# EAGLE design TouchGlove (EAGLE 9.1.2)
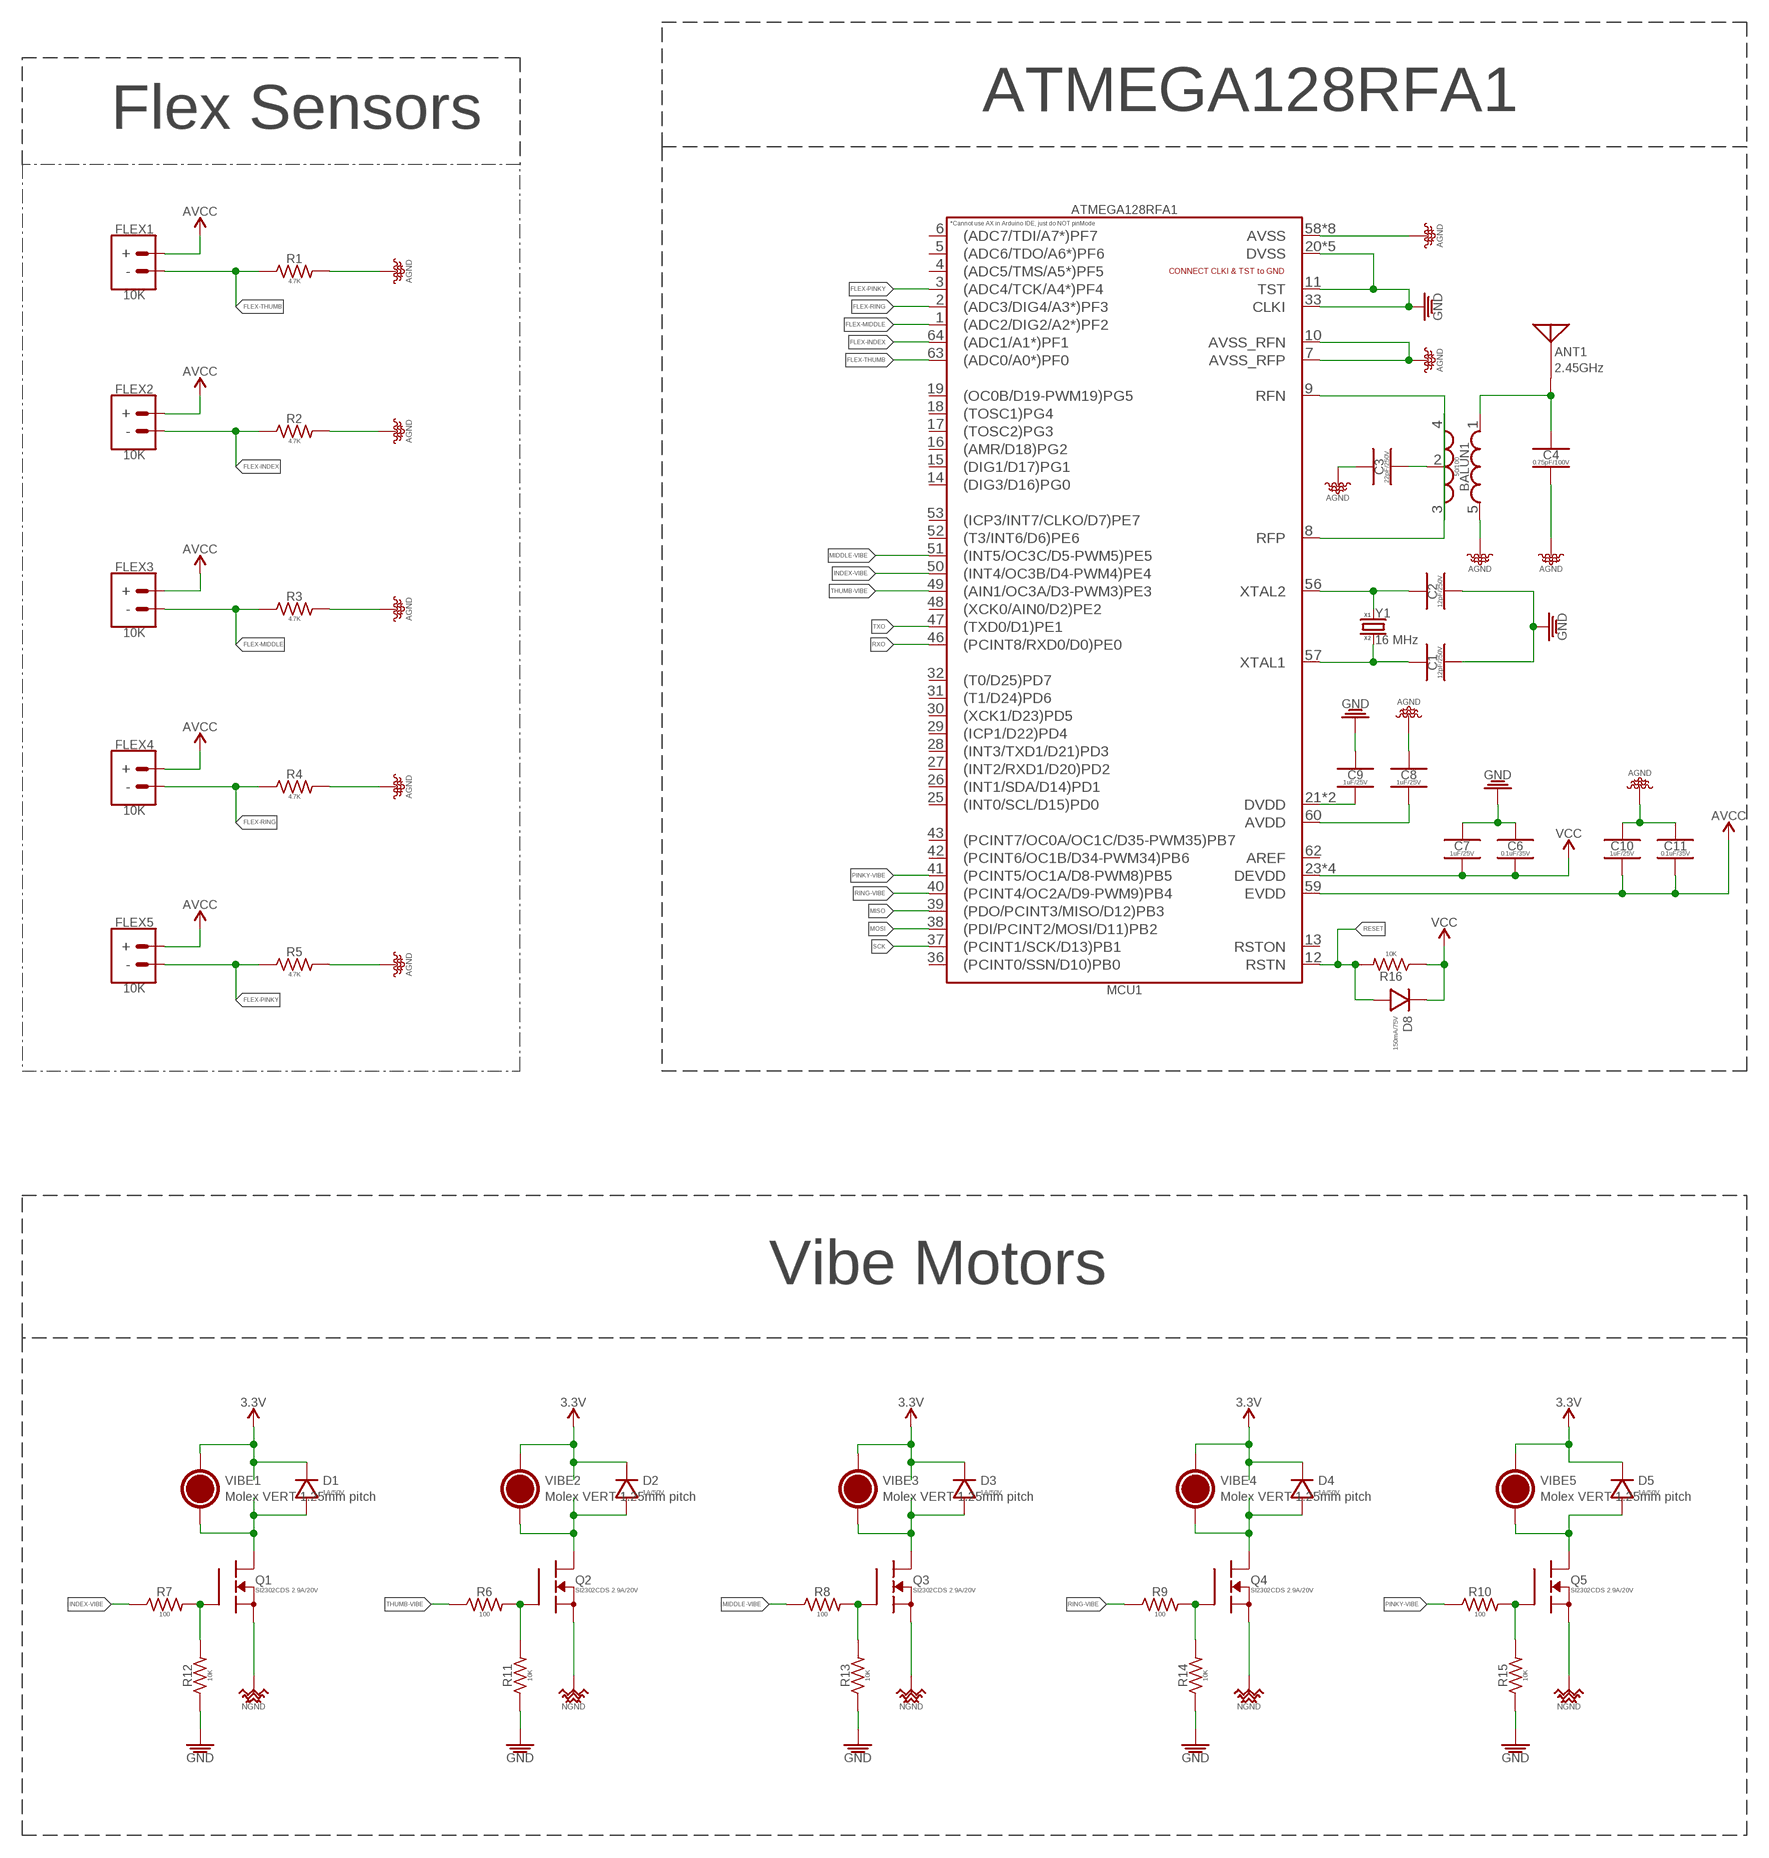
[diagram p0: schematic, sheet 1, part 1 of 2]
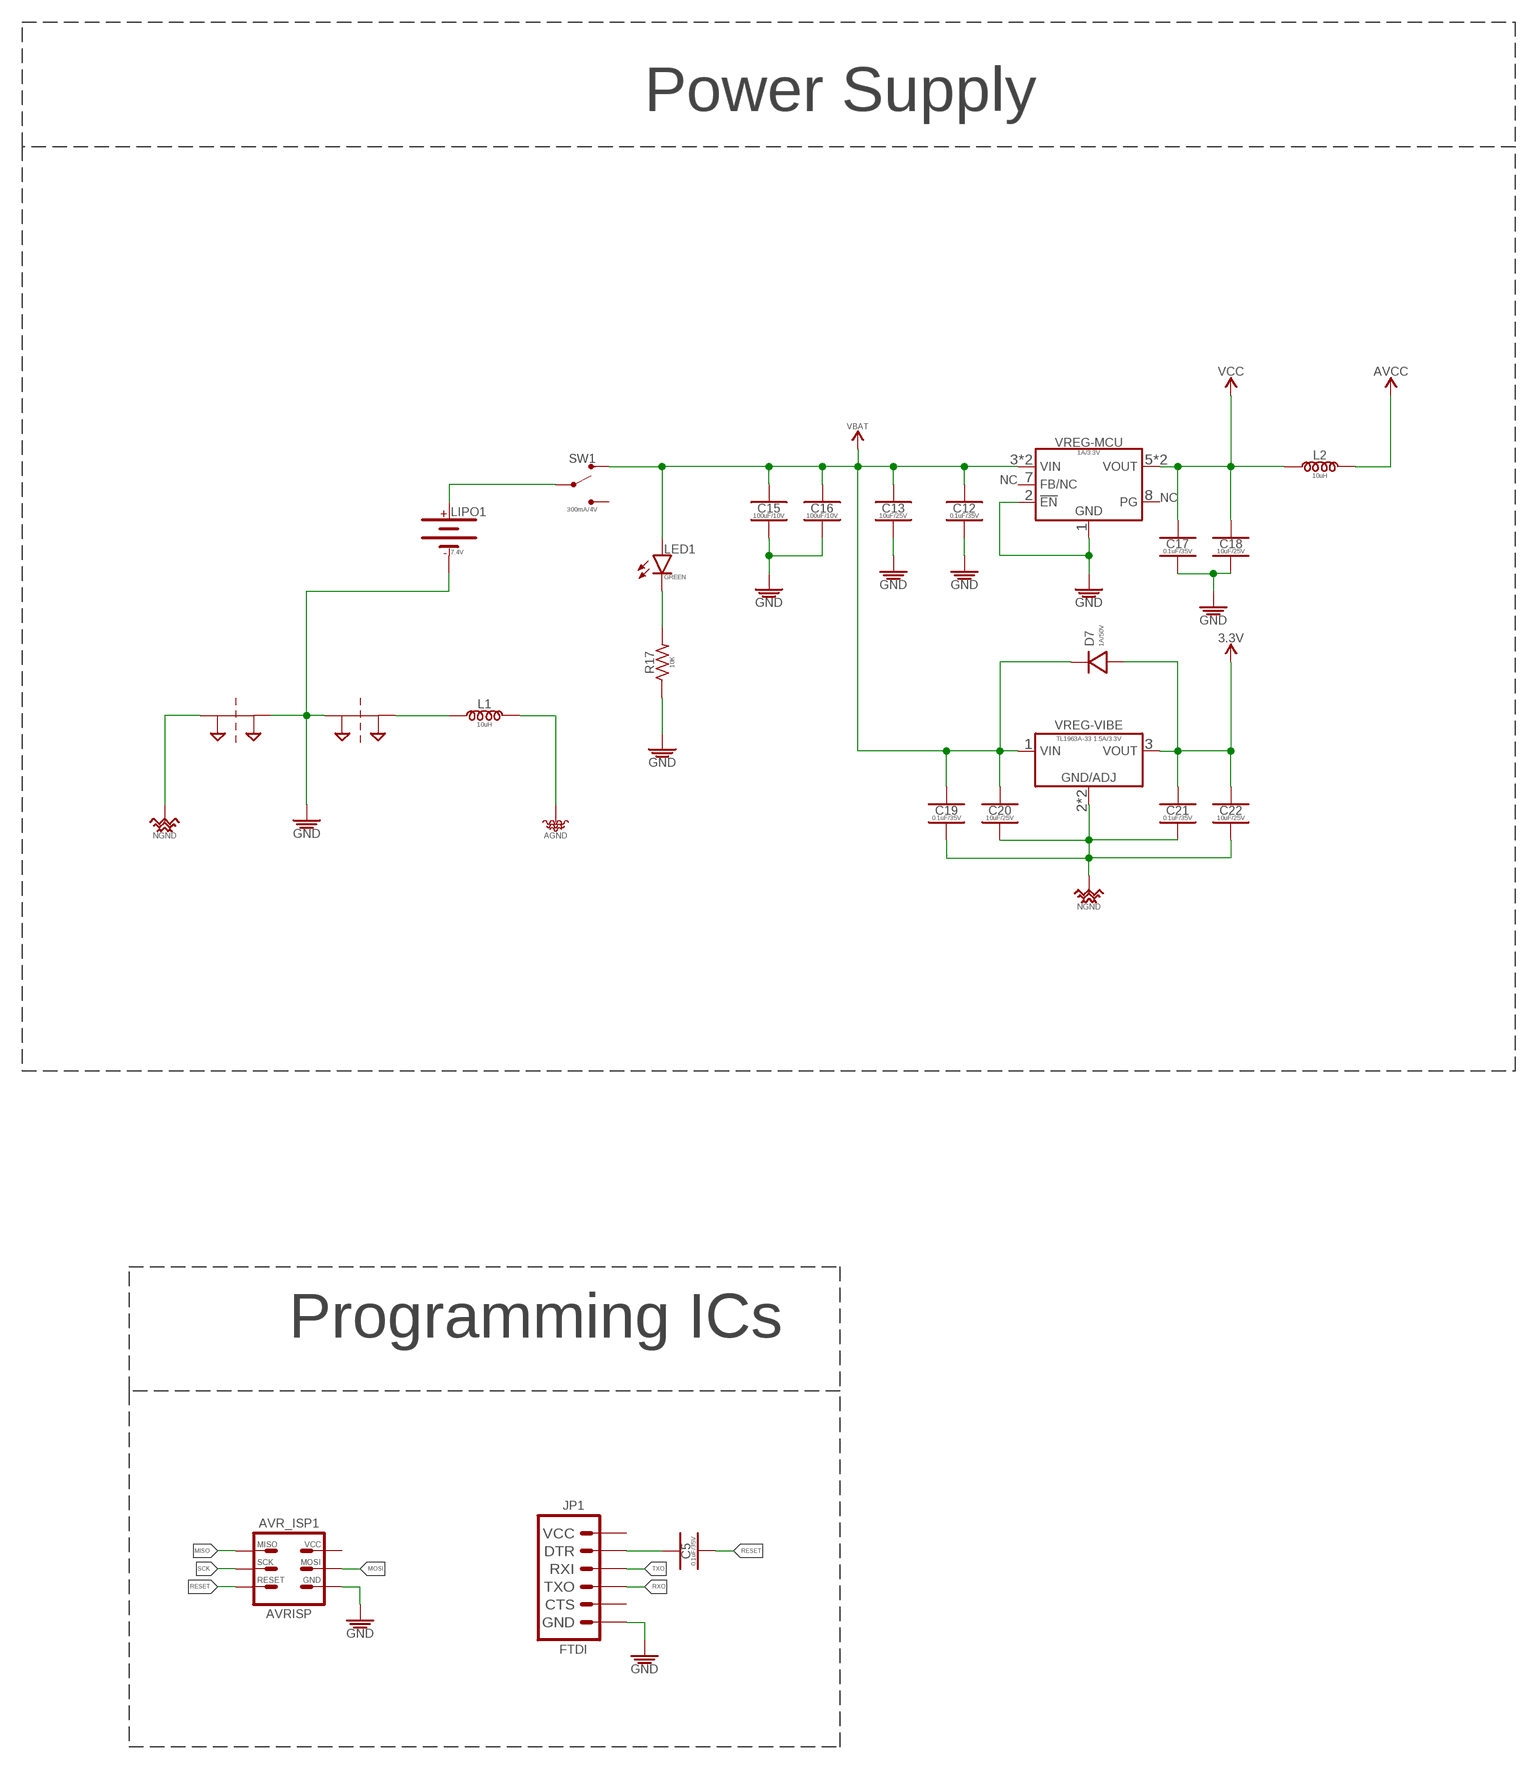
[diagram p1: schematic, sheet 1, part 2 of 2]

## Parts
ANT1  2.45GHz  ANTENNA_SMD_CHP-2.45GHZ-0.5DBI-3W  [ANTC6522X100]
AVR_ISP1  AVRISP  AVR_SPI_PRG_6_PTH_VERT-MALE  [2X3-NS]
BALUN1  50/100  BALUN_SMD-0805_UNBAL/BAL-50/100  [RESCAXE65P200X125X95-6]
C1  12pF/250V  12PF_SMD-0805_250V-5%  [CAPC2012X95_SMD-0805]
C2  12pF/250V  12PF_SMD-0805_250V-5%  [CAPC2012X95_SMD-0805]
C3  22pF/250V  22PF_CER_SMD-0805_250V-5%  [CAPC2012X95_SMD-0805]
C4  0.75pF/100V  0.75PF_CER_SMD-0805_100V-33%  [CAPC2012X95_SMD-0805]
C5  0.1uF/35V  0.1UF_SMD-0805_35V-10%  [CAPC2012X95_SMD-0805]
C6  0.1uF/35V  0.1UF_SMD-0805_35V-10%  [CAPC2012X95_SMD-0805]
C7  1uF/25V  1UF_CER_SMD-0805_25V-10%  [CAPC2012X95_SMD-0805]
C8  1uF/25V  1UF_CER_SMD-0805_25V-10%  [CAPC2012X95_SMD-0805]
C9  1uF/25V  1UF_CER_SMD-0805_25V-10%  [CAPC2012X95_SMD-0805]
C10  1uF/25V  1UF_CER_SMD-0805_25V-10%  [CAPC2012X95_SMD-0805]
C11  0.1uF/35V  0.1UF_SMD-0805_35V-10%  [CAPC2012X95_SMD-0805]
C12  0.1uF/35V  0.1UF_SMD-0805_35V-10%  [CAPC2012X95_SMD-0805]
C13  10uF/25V  10UF_CER_SMD-0805_25V-10%  [CAPC2012X95_SMD-0805]
C15  100uF/10V  100UF_CER_SMD-1210_16V-20%  [CAPC3225X270_SMD-1210]
C16  100uF/10V  100UF_CER_SMD-1210_16V-20%  [CAPC3225X270_SMD-1210]
C17  0.1uF/35V  0.1UF_SMD-0805_35V-10%  [CAPC2012X95_SMD-0805]
C18  10uF/25V  10UF_CER_SMD-0805_25V-10%  [CAPC2012X95_SMD-0805]
C19  0.1uF/35V  0.1UF_SMD-0805_35V-10%  [CAPC2012X95_SMD-0805]
C20  10uF/25V  10UF_CER_SMD-0805_25V-10%  [CAPC2012X95_SMD-0805]
C21  0.1uF/35V  0.1UF_SMD-0805_35V-10%  [CAPC2012X95_SMD-0805]
C22  10uF/25V  10UF_CER_SMD-0805_25V-10%  [CAPC2012X95_SMD-0805]
D1  1A/50V  DIODE_GENERAL-PURPOSE_SMD_GP_1A-50V  [SODFL3516X170]
D2  1A/50V  DIODE_GENERAL-PURPOSE_SMD_GP_1A-50V  [SODFL3516X170]
D3  1A/50V  DIODE_GENERAL-PURPOSE_SMD_GP_1A-50V  [SODFL3516X170]
D4  1A/50V  DIODE_GENERAL-PURPOSE_SMD_GP_1A-50V  [SODFL3516X170]
D5  1A/50V  DIODE_GENERAL-PURPOSE_SMD_GP_1A-50V  [SODFL3516X170]
D7  1A/50V  DIODE_GENERAL-PURPOSE_SMD_GP_1A-50V  [SODFL3516X170]
D8  150mA/75V  DIODE_GENERAL-PURPOSE_SMD-0402_GP_150MA-75V  [DFN100X60X55-2]
FLEX1  10K  FLEX_SENSOR_0530470210_VERT-MALE_PITCH-1.25MM  [_MOLEX-0530470210_VERT_PITCH-1.25MM]
FLEX2  10K  FLEX_SENSOR_0530470210_VERT-MALE_PITCH-1.25MM  [_MOLEX-0530470210_VERT_PITCH-1.25MM]
FLEX3  10K  FLEX_SENSOR_0530470210_VERT-MALE_PITCH-1.25MM  [_MOLEX-0530470210_VERT_PITCH-1.25MM]
FLEX4  10K  FLEX_SENSOR_0530470210_VERT-MALE_PITCH-1.25MM  [_MOLEX-0530470210_VERT_PITCH-1.25MM]
FLEX5  10K  FLEX_SENSOR_0530470210_VERT-MALE_PITCH-1.25MM  [_MOLEX-0530470210_VERT_PITCH-1.25MM]
JP1  FTDI  FTDI_PTH_RA-MALE  [FTDI_BASIC-6PIN-MALE-RA]
L1  10uH  10UH_SMD-0805_0.5A-0.65OHM-10%  [INDC2012X145]
L2  10uH  10UH_SMD-0805_0.5A-0.65OHM-10%  [INDC2012X145]
LED1  GREEN  LED_SMD-0805_DISCRETE_GREEN_  [LEDC2012X120_LED-0805]
LIPO1  7.4V  BATTERY-CONNECTOR_MOLEX_89401_RA-MALE_PITCH-2MM  [BATTERY_MOLEX-89401_RA_PITCH-2MM]
MCU1  ATMEGA128RFA1  ATMEGA128RFA1_VFQFN-64_EXPOSED-PAD  [QFN50P900X900X90-64]
Q1  SI2302CDS 2.9A/20V  MOSFET_N-CHANNEL_SI2302CDS_2.9A-20V-0.057OHM_  [SOT95P287X112-3]
Q2  SI2302CDS 2.9A/20V  MOSFET_N-CHANNEL_SI2302CDS_2.9A-20V-0.057OHM_  [SOT95P287X112-3]
Q3  SI2302CDS 2.9A/20V  MOSFET_N-CHANNEL_SI2302CDS_2.9A-20V-0.057OHM_  [SOT95P287X112-3]
Q4  SI2302CDS 2.9A/20V  MOSFET_N-CHANNEL_SI2302CDS_2.9A-20V-0.057OHM_  [SOT95P287X112-3]
Q5  SI2302CDS 2.9A/20V  MOSFET_N-CHANNEL_SI2302CDS_2.9A-20V-0.057OHM_  [SOT95P287X112-3]
R1  4.7K  4.7KΩ_SMD-0805_1/8W_5%  [RESC2012X60_SMD-0805]
R2  4.7K  4.7KΩ_SMD-0805_1/8W_5%  [RESC2012X60_SMD-0805]
R3  4.7K  4.7KΩ_SMD-0805_1/8W_5%  [RESC2012X60_SMD-0805]
R4  4.7K  4.7KΩ_SMD-0805_1/8W_5%  [RESC2012X60_SMD-0805]
R5  4.7K  4.7KΩ_SMD-0805_1/8W_5%  [RESC2012X60_SMD-0805]
R6  100  100Ω_SMD-0805_1/8W-5%  [RESC2012X60_SMD-0805]
R7  100  100Ω_SMD-0805_1/8W-5%  [RESC2012X60_SMD-0805]
R8  100  100Ω_SMD-0805_1/8W-5%  [RESC2012X60_SMD-0805]
R9  100  100Ω_SMD-0805_1/8W-5%  [RESC2012X60_SMD-0805]
R10  100  100Ω_SMD-0805_1/8W-5%  [RESC2012X60_SMD-0805]
R11  10K  10KΩ_SMD-0805_1/8W-5%  [RESC2012X60_SMD-0805]
R12  10K  10KΩ_SMD-0805_1/8W-5%  [RESC2012X60_SMD-0805]
R13  10K  10KΩ_SMD-0805_1/8W-5%  [RESC2012X60_SMD-0805]
R14  10K  10KΩ_SMD-0805_1/8W-5%  [RESC2012X60_SMD-0805]
R15  10K  10KΩ_SMD-0805_1/8W-5%  [RESC2012X60_SMD-0805]
R16  10K  10KΩ_SMD-0805_1/8W-5%  [RESC2012X60_SMD-0805]
R17  10K  10KΩ_SMD-0805_1/8W-5%  [RESC2012X60_SMD-0805]
SUPPLY38  2PT_GND_TIE  [2PT_GND_TIE]
SUPPLY39  2PT_GND_TIE  [2PT_GND_TIE]
SW1  300mA/4V  SWITCH_SPDT_RA_SMD_300MA-4V_6.7L-2.6W  [SW_SLIDE_SPDT_RA_SMD_4V_300MA_6.7L-2.6W]
VIBE1  Molex VERT 1.25mm pitch  VIBE-MOTOR_CONNECTOR_0530470210_VERT-MALE_PITCH-1.25MM  [_MOLEX-0530470210_VERT_PITCH-1.25MM]
VIBE2  Molex VERT 1.25mm pitch  VIBE-MOTOR_CONNECTOR_0530470210_VERT-MALE_PITCH-1.25MM  [_MOLEX-0530470210_VERT_PITCH-1.25MM]
VIBE3  Molex VERT 1.25mm pitch  VIBE-MOTOR_CONNECTOR_0530470210_VERT-MALE_PITCH-1.25MM  [_MOLEX-0530470210_VERT_PITCH-1.25MM]
VIBE4  Molex VERT 1.25mm pitch  VIBE-MOTOR_CONNECTOR_0530470210_VERT-MALE_PITCH-1.25MM  [_MOLEX-0530470210_VERT_PITCH-1.25MM]
VIBE5  Molex VERT 1.25mm pitch  VIBE-MOTOR_CONNECTOR_0530470210_VERT-MALE_PITCH-1.25MM  [_MOLEX-0530470210_VERT_PITCH-1.25MM]
VREG-MCU  1A/3.3V  VREG_TPS768XX_ULDO_FAST-TRANSIENT_TPS76833QDR_1A-3.3V  [SOIC127P600X265-8]
VREG-VIBE  TL1963A-33 1.5A/3.3V  VREG_TL1963A-XX_1.5A_LN_LDO_FAST-TRANSIENT_SOT-223-4_TL1963A-33_1.5A-3.3V  [SOT229P700X180-4]
Y1  16 MHz  CRYSTAL_ABM3B_16MHZ_18PF  [OSCCC500X320X110]

## Nets
3.3V: C21.1 C22.1 D1.K D2.K D3.K D4.K D5.K D7.A VIBE1.1(+) VIBE2.1(+) VIBE3.1(+) VIBE4.1(+) VIBE5.1(+) VREG-VIBE.3(VO)
AGND: BALUN1.5(GND) C3.1 C4.2 C8.1 C10.1 C11.1 L1.2 MCU1.7(AVSS_RFP) MCU1.10(AVSS_RFN) MCU1.58(AVSS) MCU1.61(AVSS) MCU1.EP(AVSS) MCU1.P$1(AVSS) MCU1.P$2(AVSS) MCU1.P$3(AVSS) MCU1.P$4(AVSS) MCU1.P$5(AVSS) R1.2 R2.2 R3.2 R4.2 R5.2
AVCC: C10.2 C11.2 FLEX1.1(+) FLEX2.1(+) FLEX3.1(+) FLEX4.1(+) FLEX5.1(+) L2.2 MCU1.59(EVDD)
FLEX-INDEX: FLEX2.2(-) MCU1.64((ADC1/A1*)PF1) R2.1
FLEX-MIDDLE: FLEX3.2(-) MCU1.1((ADC2/DIG2/A2*)PF2) R3.1
FLEX-PINKY: FLEX5.2(-) MCU1.3((ADC4/TCK/A4*)PF4) R5.1
FLEX-RING: FLEX4.2(-) MCU1.2((ADC3/DIG4/A3*)PF3) R4.1
FLEX-THUMB: FLEX1.2(-) MCU1.63((ADC0/A0*)PF0) R1.1
GND: AVR_ISP1.GND C1.2 C2.2 C6.1 C7.1 C9.1 C12.2 C13.2 C15.2 C16.2 C17.2 C18.2 JP1.GND LIPO1.- MCU1.11(TST) MCU1.20(DVSS) MCU1.24(DVSS) MCU1.33(CLKI) MCU1.35(DVSS) MCU1.45(DVSS) MCU1.55(DVSS) R11.1 R12.1 R13.1 R14.1 R15.1 R17.1 SUPPLY38.P$2 SUPPLY39.P$1 VREG-MCU.1(GND) VREG-MCU.2(!EN)
INDEX-VIBE: MCU1.50((INT4/OC3B/D4-PWM4)PE4) R7.1
MIDDLE-VIBE: MCU1.51((INT5/OC3C/D5-PWM5)PE5) R8.1
MISO: AVR_ISP1.MISO MCU1.39((PDO/PCINT3/MISO/D12)PB3)
MOSI: AVR_ISP1.MOSI MCU1.38((PDI/PCINT2/MOSI/D11)PB2)
N$1: D1.A Q1.3(D) VIBE1.2(-)
N$2: D2.A Q2.3(D) VIBE2.2(-)
N$3: D3.A Q3.3(D) VIBE3.2(-)
N$4: D4.A Q4.3(D) VIBE4.2(-)
N$5: D5.A Q5.3(D) VIBE5.2(-)
N$6: C2.1 MCU1.56(XTAL2) Y1.1(XTAL1)
N$7: C1.1 MCU1.57(XTAL1) Y1.3(XTAL2)
N$8: BALUN1.2(GND) C3.2
N$9: ANT1.1(SIGNAL) BALUN1.1(IN) C4.1
N$10: BALUN1.3(OUT1) MCU1.9(RFN)
N$11: BALUN1.4(OUT2) MCU1.8(RFP)
N$12: C5.1 JP1.DTR
N$14: Q2.1(G) R6.2 R11.2
N$15: LIPO1.+ SW1.2(P)
N$16: Q1.1(G) R7.2 R12.2
N$18: Q3.1(G) R8.2 R13.2
N$19: L1.1 SUPPLY39.P$2
N$20: Q4.1(G) R9.2 R14.2
N$21: C8.2 MCU1.60(AVDD)
N$22: Q5.1(G) R10.2 R15.2
N$23: C9.2 MCU1.21(DVDD) MCU1.22(DVDD)
N$25: LED1.K R17.2
NGND: C19.2 C20.2 C21.2 C22.2 Q1.2(S) Q2.2(S) Q3.2(S) Q4.2(S) Q5.2(S) SUPPLY38.P$1 VREG-VIBE.2(GND) VREG-VIBE.4(GND)
PINKY-VIBE: MCU1.41((PCINT5/OC1A/D8-PWM8)PB5) R10.1
RESET: AVR_ISP1.RESET C5.2 D8.A MCU1.12(RSTN) R16.2
RING-VIBE: MCU1.40((PCINT4/OC2A/D9-PWM9)PB4) R9.1
RXO: JP1.TXO MCU1.46((PCINT8/RXD0/D0)PE0)
SCK: AVR_ISP1.SCK MCU1.37((PCINT1/SCK/D13)PB1)
THUMB-VIBE: MCU1.49((AIN1/OC3A/D3-PWM3)PE3) R6.1
TXO: JP1.RXI MCU1.47((TXD0/D1)PE1)
VBAT: C12.1 C13.1 C15.1 C16.1 C19.1 C20.1 D7.K LED1.A SW1.1(S1) VREG-MCU.3(VIN) VREG-MCU.4(VIN) VREG-VIBE.1(VI)
VCC: C6.2 C7.2 C17.1 C18.1 D8.K L2.1 MCU1.23(DEVDD) MCU1.34(DEVDD) MCU1.44(DEVDD) MCU1.54(DEVDD) R16.1 VREG-MCU.5(VOUT) VREG-MCU.6(VOUT)
Unconnected: AVR_ISP1.VCC JP1.CTS JP1.VCC MCU1.4((ADC5/TMS/A5*)PF5) MCU1.5((ADC6/TDO/A6*)PF6) MCU1.6((ADC7/TDI/A7*)PF7) MCU1.13(RSTON) MCU1.14((DIG3/D16)PG0) MCU1.15((DIG1/D17)PG1) MCU1.16((AMR/D18)PG2) MCU1.17((TOSC2)PG3) MCU1.18((TOSC1)PG4) MCU1.19((OC0B/D19-PWM19)PG5) MCU1.25((INT0/SCL/D15)PD0) MCU1.26((INT1/SDA/D14)PD1) MCU1.27((INT2/RXD1/D20)PD2) MCU1.28((INT3/TXD1/D21)PD3) MCU1.29((ICP1/D22)PD4) MCU1.30((XCK1/D23)PD5) MCU1.31((T1/D24)PD6) MCU1.32((T0/D25)PD7) MCU1.36((PCINT0/SSN/D10)PB0) MCU1.42((PCINT6/OC1B/D34-PWM34)PB6) MCU1.43((PCINT7/OC0A/OC1C/D35-PWM35)PB7) MCU1.48((XCK0/AIN0/D2)PE2) MCU1.52((T3/INT6/D6)PE6) MCU1.53((ICP3/INT7/CLKO/D7)PE7) MCU1.62(AREF) SW1.3(S2) VREG-MCU.7(FB/NC) VREG-MCU.8(PG)

## Notes on the sheet
- Flex Sensors | ATMEGA128RFA1 | Power Supply
- Vibe Motors
- Programming ICs

## Library data of the parts
ANT1 = PiB_radio_frequency:ANTENNA: Chip antenna Single endded antenna. Common with smaller chip antennas. CHIP4 package is the GPS Chip Antenna SKU: GPS-08418. CHIP5 package is 2.4GHz chip antenna SKU: WRL-00144.; DATASHEET: https://linxtechnologies.com/wp/wp-content/uploads/ant-fff-chp-x.pdf; DIST: Digikey; DISTLINK: https://www.digikey.com/products/en?keywords=ANT-2.45-CHPCT-ND; DISTPN: ANT-2.45-CHPCT-ND; MFR: Linx Technologies Inc.; MPN: ANT-2.45-CHP-T
AVR_ISP1 = PiB_connectors:AVR_SPI_PRG_6: AVR ISP 6 Pin This is the reduced ISP connector for AVR programming. Common on Arduino. This footprint will take up less PCB space and can be used with a 10-pin to 6-pin adapter such as SKU: BOB-08508; DATASHEET: https://cdn.amphenol-icc.com/media/wysiwyg/files/drawing/67996.pdf; DIST: Digikey; DISTLINK: https://www.digikey.com/products/en?keywords=609-3234-ND; DISTPN: 609-3234-ND; MFR: Amphenol FCI; MPN: 67997-206HLF
BALUN1 = PiB_radio_frequency:BALUN: 0805 footprint balun- Ember 351/357; DATASHEET: http://katalog.we-online.de/pbs/datasheet/748421245.pdf; DIST: Digikey; DISTLINK: https://www.digikey.com/products/en?keywords=732-2230-6-ND; DISTPN: 732-2230-6-ND; MFR: Wurth Electronics Inc.; MPN: 748421245
C1 C2 = PiB_capacitors:12PF; DATASHEET: http://search.murata.co.jp/Ceramy/image/img/A01X/G101/ENG/GRM21A5C2E120JW01-01.pdf; DIST: Digikey; DISTLINK: https://www.digikey.com/products/en?keywords=490-5531-1-ND; DISTPN: 490-5531-1-ND; MFR: Murata Electronics North America; MPN: GRM21A5C2E120JW01D
C3 = PiB_capacitors:22PF; DATASHEET: http://search.murata.co.jp/Ceramy/image/img/A01X/G101/ENG/GRM21A5C2E220JW01-01.pdf; DIST: Digikey; DISTPN: 490-5534-1-ND; MFR: Murata Electronics North America; MPN: GRM21A5C2E220JW01D
C4 = PiB_capacitors:0.75PF; DATASHEET: http://search.murata.co.jp/Ceramy/image/img/A01X/G101/ENG/GQM2195C2AR75CB01-01.pdf; DIST: Digikey; DISTLINK: https://www.digikey.com/products/en?keywords=490-3585-1-ND; DISTPN: 490-3585-1-ND; MFR: Murata Electronics North America; MPN: GQM2195C2AR75CB01D
C5 C6 C11 C12 C17 C19 C21 = PiB_capacitors:0.1UF; DATASHEET: http://ds.yuden.co.jp/TYCOMPAS/ut/detail.do?productNo=GMK212BJ104KGHT&fileName=GMK212BJ104KGHT_SS&mode=specSheetDownload; DIST: Digikey; DISTLINK: https://www.digikey.com/products/en?keywords=587-3364-1-ND; DISTPN: 587-3364-1-ND; MFR: Taiyo Yuden; MPN: GMK212BJ104KGHT
C7-C10 = PiB_capacitors:1UF; DATASHEET: https://search.murata.co.jp/Ceramy/image/img/A01X/G101/ENG/GRM216R61E105KA12-01.pdf; DIST: Digikey; DISTLINK: https://www.digikey.com/products/en?keywords=490-1700-1-ND; DISTPN: 490-1700-1-ND; MFR: Murata Electronics North America; MPN: GRM216R61E105KA12D
C13 C18 C20 C22 = PiB_capacitors:10UF; DATASHEET: https://www.yuden.co.jp/productdata/catalog/mlcc_all_e.pdf; DIST: Digikey; DISTLINK: https://www.digikey.com/products/en?keywords=587-2985-1-ND; DISTPN: 587-2985-1-ND; MFR: Taiyo Yuden; MPN: TMK212BBJ106KG-T
C15 C16 = PiB_capacitors:100UF; DATASHEET: https://www.yuden.co.jp/productdata/catalog/mlcc01_hq_e.pdf; DIST: Digikey; DISTLINK: https://www.digikey.com/products/en?keywords=587-3432-1-ND; DISTPN: 587-3432-1-ND; MFR: Taiyo Yuden; MPN: LMK325ABJ107MMHT
D1-D5 D7 = PiB_discrete_semiconductors:DIODE_GENERAL-PURPOSE; DATASHEET: http://www.comchiptech.com/cms/UserFiles/CGRKM4001-HF%20Thru.%20CGRKM4007-HF%20RevG.pdf; DIST: Digikey; DISTLINK: https://www.digikey.com/products/en?keywords=641-1511-1-ND; DISTPN: 641-1511-1-ND; MFR: Comchip Technology; MPN: CGRKM4001-HF
D8 = PiB_discrete_semiconductors:DIODE_GENERAL-PURPOSE; DATASHEET: http://www.comchiptech.com/cms/UserFiles/CDSQR4148-HF-RevC213424.pdf; DIST: Digikey; DISTLINK: https://www.digikey.com/products/en?keywords=641-1677-1-ND; DISTPN: 641-1677-1-ND; MFR: Comchip Technology; MPN: CDSQR4148-HF
FLEX1-FLEX5 = PiB_sensors:FLEX_SENSOR; DATASHEET: http://www.spectrasymbol.com/wp-content/uploads/2016/12/FLEX-SENSOR-DATA-SHEET-v2014-Rev-A.pdf; DATASHEET_CONNECTOR1: https://www.molex.com/pdm_docs/sd/530470210_sd.pdf; DATASHEET_CONNECTOR2: https://www.molex.com/pdm_docs/sd/510210700_sd.pdf; DATASHEET_CRIMP: https://www.molex.com/pdm_docs/sd/500798000_sd.pdf; DIST: Sparkfun; DISTLINK: https://www.sparkfun.com/products/8606; DISTLINK_CONNECTOR1: https://www.digikey.com/products/en?keywords=WM1731-ND; DISTLINK_CONNECTOR2: https://www.digikey.com/products/en?keywords=WM1720-ND; DISTLINK_CRIMP: https://www.digikey.com/products/en?keywords=WM1142CT-ND; DISTPN: SEN-08606; DISTPN_CONNECTOR1: WM1731-ND; DISTPN_CONNECTOR2: WM1720-ND; DISTPN_CRIMP: WM1142CT-ND; DIST_CONNECTOR1: Digikey; DIST_CONNECTOR2: Digikey; DIST_CRIMP: Digikey; MFR: Spectra Symbol; MFR_CONNECTOR1: Molex, LLC; MFR_CONNECTOR2: Molex, LLC; MFR_CRIMP: Molex, LLC; MPN: FS-L-0095-103-ST; MPN_CONNECTOR1: 0530470210; MPN_CONNECTOR2: 51021-0200; MPN_CRIMP: 0500798000
JP1 = PiB_connectors:FTDI: FTDI Basic header with labels; DATASHEET: https://media.digikey.com/pdf/Data%20Sheets/Sparkfun%20PDFs/DEV-09873_Web.pdf; DATASHEET_CONNECTOR: https://cdn.amphenol-icc.com/media/wysiwyg/files/drawing/68015.pdf; DIST: Digikey; DISTLINK: https://www.digikey.com/products/en?keywords=1568-1104-ND; DISTLINK_CONNECTOR: https://www.digikey.com/products/en?keywords=609-3327-ND; DISTPN: 1568-1104-ND; DISTPN_CONNECTOR: 609-3327-ND; DIST_CONNECTOR: Digikey; MFR: SparkFun Electronics; MFR_CONNECTOR: Amphenol FCI; MPN: DEV-09873; MPN_CONNECTOR: 68016-406HLF
L1 L2 = PiB_inductors:10UH; DATASHEET: https://www.yuden.co.jp/productdata/catalog/wound02_e.pdf; DIST: Digikey; DISTLINK: https://www.digikey.com/products/en?keywords=587-2452-1-ND; DISTPN: 587-2452-1-ND; MFR: Taiyo Yuden; MPN: CB2012T100KR
LED1 = PiB_leds:LED; DATASHEET: http://optoelectronics.liteon.com/upload/download/DS22-2000-073/LTST-C170KGKT.pdf; DIST: Digikey; DISTLINK: https://www.digikey.com/products/en?keywords=160-1414-1-ND; DISTPN: 160-1414-1-ND; MFR: Lite-On Inc.; MPN: LTST-C170KGKT
LIPO1 = PiB_batteries:BATTERY-CONNECTOR_MOLEX; DATASHEET: https://www.molex.com/pdm_docs/sd/894010210_sd.pdf; DATASHEET_CONNECTOR: https://www.molex.com/pdm_docs/sd/873690200_sd.pdf; DATASHEET_CRIMP: https://www.molex.com/pdm_docs/sd/502128000_sd.pdf; DIST: Digikey; DISTLINK: https://www.digikey.com/products/en?keywords=WM14854-ND; DISTLINK_CONNECTOR: https://www.digikey.com/products/en?keywords=WM10118-ND; DISTLINK_CRIMP: https://www.digikey.com/products/en?keywords=WM4561CT-ND; DISTPN: WM14854-ND; DISTPN_CONNECTOR: WM10118-ND; DISTPN_CRIMP: WM4561CT-ND; DIST_CONNECTOR: Digikey; DIST_CRIMP: Digikey; MFR: Molex, LLC; MFR_CONNECTOR: Molex, LLC; MFR_CRIMP: Molex, LLC; MPN: 0894010210; MPN_CONNECTOR: 0873690200; MPN_CRIMP: 50212-8000
MCU1 = PiB_ic_microcontrollers:ATMEGA128RFA1: ATmega128RFA1 8-bit AVR Microcontroller with Low Power 2.4GHz Transceiver for ZigBee and IEEE 802.15.4; DATASHEET: http://www.microchip.com/mymicrochip/filehandler.aspx?ddocname=en590262; DIST: Digikey; DISTLINK: https://www.digikey.com/products/en?keywords=ATMEGA128RFA1-ZU-ND; DISTPN: ATMEGA128RFA1-ZU-ND; MFR: Microchip Technology; MPN: ATMEGA128RFA1-ZU
Q1-Q5 = PiB_discrete_semiconductors:MOSFET_N-CHANNEL; DATASHEET: http://www.vishay.com/docs/63653/si2302dds.pdf; DIST: Digikey; DISTLINK: https://www.digikey.com/products/en?keywords=SI2302DDS-T1-GE3CT-ND; DISTPN: SI2302DDS-T1-GE3CT-ND; MFR: Vishay Siliconix; MPN: SI2302DDS-T1-GE3
R1-R5 = PiB_resistors:4.7KΩ; DATASHEET: http://www.yageo.com/NewPortal/yageodocoutput?fileName=/pdf/R-Chip/PYu-RC_51_RoHS_P_0.pdf; DIST: Digikey; DISTLINK: https://www.digikey.com/products/en?keywords=YAG1334CT-ND; DISTPN: YAG1334CT-ND; MFR: Yageo; MPN: RC0805JR-074K7P
R6-R10 = PiB_resistors:100Ω; DATASHEET: http://www.yageo.com/NewPortal/yageodocoutput?fileName=/pdf/R-Chip/PYu-AC_51_RoHS_L_6.pdf; DIST: Digikey; DISTLINK: https://www.digikey.com/products/en?keywords=YAG3757CT-ND; DISTPN: YAG3757CT-ND; MFR: Yageo; MPN: AC0805JR-07100RL
R11-R17 = PiB_resistors:10KΩ; DATASHEET: http://www.yageo.com/documents/recent/PYu-RC_Group_51_RoHS_L_9.pdf; DIST: Digikey; DISTLINK: https://www.digikey.com/products/en?keywords=311-10KARCT-ND; DISTPN: 311-10KARCT-ND; MFR: Yageo; MPN: RC0805JR-0710KL
SUPPLY38 SUPPLY39 = PiB_power_symbols:2PT_GND_TIE
SW1 = PiB_switches:SWITCH_SPDT; CREATOR: MrSwirlyEyes; DATASHEET: https://media.digikey.com/pdf/Data%20Sheets/APEM%20Components%20PDFs/MA_Series_.pdf; DIST: Digikey; DISTLINK: https://www.digikey.com/products/en?keywords=679-1847-1-ND; DISTPN: 679-1847-1-ND; MFR: APEM Inc.; MPN: MA12RTR; TESTED: YES
VIBE1-VIBE5 = PiB_actuators:VIBE-MOTOR_CONNECTOR; DATASHEET: http://www.vibration-motor.com/products/download/C0825B002F.pdf; DATASHEET_CONNECTOR1: https://www.molex.com/pdm_docs/sd/530470210_sd.pdf; DATASHEET_CONNECTOR2: https://www.molex.com/pdm_docs/sd/510210700_sd.pdf; DATASHEET_CRIMP: https://www.molex.com/pdm_docs/sd/500798000_sd.pdf; DIST: Digikey; DISTLINK: https://www.digikey.com/products/en?keywords=1670-1002-ND; DISTLINK_CONNECTOR1: https://www.digikey.com/products/en?keywords=WM1731-ND; DISTLINK_CONNECTOR2: https://www.digikey.com/products/en?keywords=WM1720-ND; DISTLINK_CRIMP: https://www.digikey.com/products/en?keywords=WM1142CT-ND; DISTPN: 1670-1002-ND; DISTPN_CONNECTOR1: WM1731-ND; DISTPN_CONNECTOR2: WM1720-ND; DISTPN_CRIMP: WM1142CT-ND; DIST_CONNECTOR1: Digikey; DIST_CONNECTOR2: Digikey; DIST_CRIMP: Digikey; MFR: Jinlong Machinery & Electronics, Inc.; MFR_CONNECTOR1: Molex, LLC; MFR_CONNECTOR2: Molex, LLC; MFR_CRIMP: Molex, LLC; MPN: C0825B002F; MPN_CONNECTOR1: 0530470210; MPN_CONNECTOR2: 51021-0200; MPN_CRIMP: 0500798000
VREG-MCU = PiB_ic_power:VREG_TPS768XX_ULDO_FAST-TRANSIENT; DATASHEET: http://www.ti.com/lit/ds/symlink/tps768.pdf; DIST: Digikey; DISTLINK: https://www.digikey.com/products/en?keywords=296-46395-1-ND; DISTPN: 296-46395-1-ND; MFR: Texas Instruments; MPN: TPS76833QDR
VREG-VIBE = PiB_ic_power:VREG_TL1963A-XX_1.5A_LN_LDO_FAST-TRANSIENT; DATASHEET: TL1963A-xx DatasheetTL1963A-xx; DIST: Digikey; DISTLINK: https://www.digikey.com/products/en?keywords=296-24897-1-ND; DISTPN: 296-24897-1-ND; MFR: Texas Instruments; MPN: TL1963A-33DCYR
Y1 = PiB:CRYSTAL: Various standard crystals. Proven footprints.; DATASHEET: https://abracon.com/Resonators/abm3b.pdf; DIST: Digikey; DISTLINK: https://www.digikey.com/products/en?keywords=535-9122-1-ND; DISTPN: 535-9122-1-ND; MFR: Abracon LLC; MPN: ABM3B-16.000MHZ-B2-T

## Board
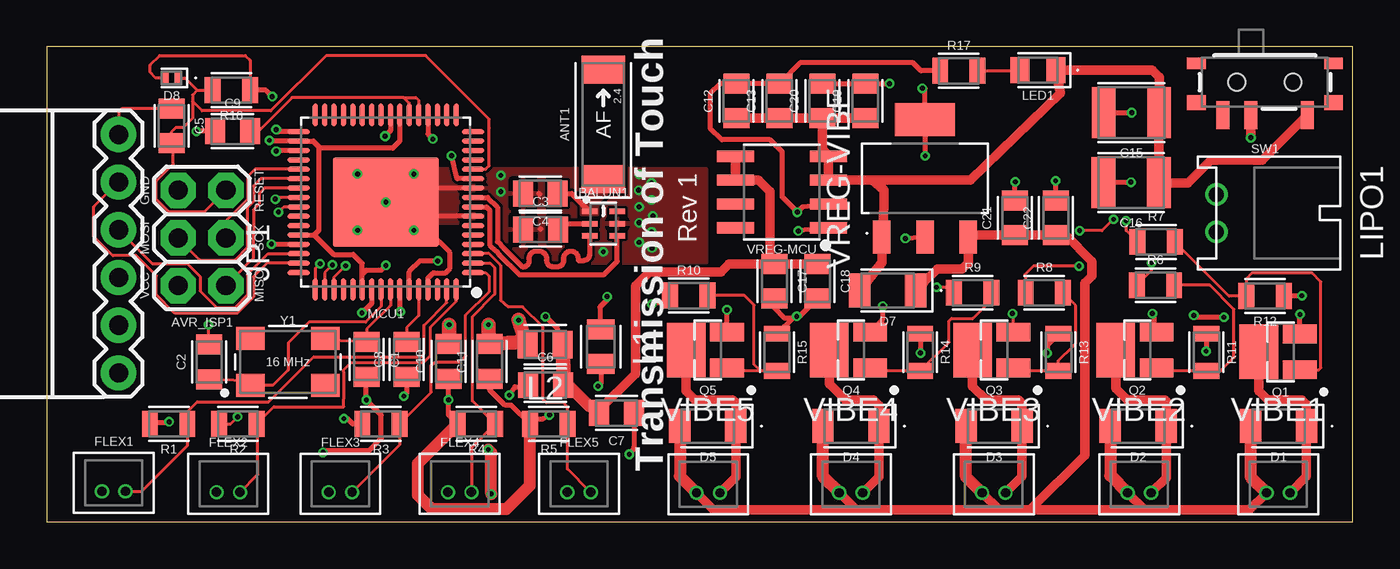
[diagram p2: board, top side]
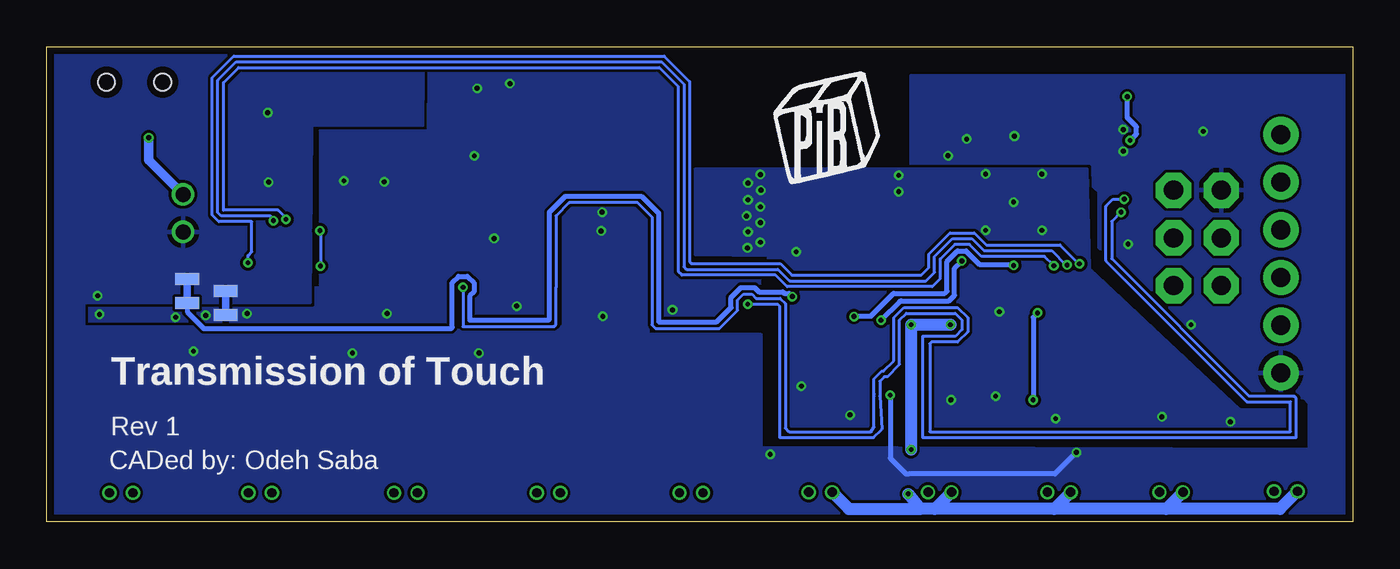
[diagram p3: board, bottom side, seen from below]

Size 69.5 x 25.3 mm. Coordinates in mm from the lower left corner, seen from the top.
Outline: 0,0 69.5,0 69.5,25.3 0,25.3 0,0
Copper layers (1*16): Top 0.035559375mm / dielectric 1.6mm / Bottom 0.035559375mm
Design rules "oshpark-2layer": minimum track width 6mil, minimum drill 10mil, track to track 6mil, track to pad 6mil, pad to pad 6mil, via to via 6mil, smd to smd 6mil, copper to edge 15mil, drill to drill 6mil, minimum pad ring 5mil, minimum via ring 5mil, stop-mask expansion 2.5mil, vias tented up to drill 0mil, thermal gap 10mil
tRestrict: area 24,19 to 35,25

### Footprints (pad centres in the part's own frame; a part is rotated, then mirrored left to right if it is on the bottom)
ANTC6522X100 = smd 1.478 x 2.312: 1 -2.917,0 | smd 1.482 x 2.312: 2 2.915,0
2X3-NS = drill 1.016 pad 1.88 octagon: GND 2.54,1.27; MISO -2.54,-1.27; MOSI 0,1.27; RESET 2.54,-1.27; SCK 0,-1.27; VCC -2.54,1.27
RESCAXE65P200X125X95-6 = smd 0.818 x 0.289: 1 -0.73,0.65; 2 -0.73,0; 3 -0.73,-0.65; 4 0.73,-0.65; 5 0.73,0; 6 0.73,0.65
CAPC2012X95_SMD-0805 = smd 1.065 x 1.379: 1 -0.925,0; 2 0.925,0
CAPC3225X270_SMD-1210 = smd 1.26 x 2.715: 1 -1.475,0; 2 1.475,0
SODFL3516X170 = smd 1.136 x 1.815: A -1.489,0; K 1.489,0
DFN100X60X55-2 = smd 0.41 x 0.55: A -0.37,0; K 0.37,0
_MOLEX-0530470210_VERT_PITCH-1.25MM = drill 0.5: 1 -0.625,0; 2 0.625,0
FTDI_BASIC-6PIN-MALE-RA = drill 1.016 pad 1.88: CTS 0,3.76; DTR 0,-6.4; GND 0,6.3; RXI 0,-3.86; TXO 0,-1.32; VCC 0,1.22
INDC2012X145 = smd 1.065 x 1.465: 1 -0.925,0; 2 0.925,0
LEDC2012X120_LED-0805 = smd 1.01 x 1.379: A -0.96,0; K 0.96,0
BATTERY_MOLEX-89401_RA_PITCH-2MM = drill 0.8: + -1,0; - 1,0
QFN50P900X900X90-64 = smd 1.2 x 0.264: 1 -4.645,3.75; 2 -4.645,3.25; 3 -4.645,2.75; 4 -4.645,2.25; 5 -4.645,1.75; 6 -4.645,1.25; 7 -4.645,0.75; 8 -4.645,0.25; 9 -4.645,-0.25; 10 -4.645,-0.75; 11 -4.645,-1.25; 12 -4.645,-1.75; 13 -4.645,-2.25; 14 -4.645,-2.75; 15 -4.645,-3.25; 16 -4.645,-3.75; 33 4.645,-3.75; 34 4.645,-3.25; 35 4.645,-2.75; 36 4.645,-2.25; 37 4.645,-1.75; 38 4.645,-1.25; 39 4.645,-0.75; 40 4.645,-0.25; 41 4.645,0.25; 42 4.645,0.75; 43 4.645,1.25; 44 4.645,1.75; 45 4.645,2.25; 46 4.645,2.75; 47 4.645,3.25; 48 4.645,3.75 | smd 0.264 x 1.2: 17 -3.75,-4.645; 18 -3.25,-4.645; 19 -2.75,-4.645; 20 -2.25,-4.645; 21 -1.75,-4.645; 22 -1.25,-4.645; 23 -0.75,-4.645; 24 -0.25,-4.645; 25 0.25,-4.645; 26 0.75,-4.645; 27 1.25,-4.645; 28 1.75,-4.645; 29 2.25,-4.645; 30 2.75,-4.645; 31 3.25,-4.645; 32 3.75,-4.645; 49 3.75,4.645; 50 3.25,4.645; 51 2.75,4.645; 52 2.25,4.645; 53 1.75,4.645; 54 1.25,4.645; 55 0.75,4.645; 56 0.25,4.645; 57 -0.25,4.645; 58 -0.75,4.645; 59 -1.25,4.645; 60 -1.75,4.645; 61 -2.25,4.645; 62 -2.75,4.645; 63 -3.25,4.645; 64 -3.75,4.645 | smd 5.65 x 4.75: EP 0,0 | drill 0.254: P$1 -1.5,1.5; P$2 1.5,1.5; P$3 1.5,-1.5; P$4 -1.5,-1.5; P$5 0,0
SOT95P287X112-3 = smd 1.8 x 1: 1 -1.025,0.95; 2 -1.025,-0.95 | smd 2.05 x 2.9: 3 1.15,0
RESC2012X60_SMD-0805 = smd 0.838 x 1.379: 1 -0.995,0; 2 0.995,0
2PT_GND_TIE = smd 0.635 x 1.27: P$1 -0.635,0; P$2 0.635,0
SW_SLIDE_SPDT_RA_SMD_4V_300MA_6.7L-2.6W = smd 1.5 x 0.7: 1 1.75,2.25; 2 1.75,-0.75; 3 1.75,-2.25 | smd 0.6 x 1: NC1 -1,-3.65; NC3 -1,3.65 | smd 0.8 x 1: NC2 1.1,-3.65; NC4 1.1,3.65 | hole 0.9: 0,-1.5; 0,1.5
SOIC127P600X265-8 = smd 1.968 x 0.599: 1 -2.473,1.905; 2 -2.473,0.635; 3 -2.473,-0.635; 4 -2.473,-1.905; 5 2.473,-1.905; 6 2.473,-0.635; 7 2.473,0.635; 8 2.473,1.905
SOT229P700X180-4 = smd 1.76 x 0.932: 1 -3.125,2.3; 2 -3.125,0; 3 -3.125,-2.3 | smd 1.76 x 3.189: 4 3.125,0
OSCCC500X320X110 = smd 1.512 x 1.212: 1 -2,-1.25; 2 2,-1.25; 3 2,1.25; 4 -2,1.25

### Placement (x,y rotation side)
ANT1  29.62,21.18 90 top
AVR_ISP1  8.26,15.13 90 top
BALUN1  29.62,15.89 0 top
C1  17.02,8.65 270 top
C2  8.64,8.53 90 top
C3  26.28,15.58 0 top
C4  26.27,17.5 180 top
C5  6.63,21.1 270 top
C6  26.54,7.29 0 top
C7  30.32,5.8 180 top
C8  19.15,8.65 90 top
C9  9.88,20.81 0 top
C10  21.38,8.55 90 top
C11  23.56,8.55 90 top
C12  36.7,22.42 90 top
C13  38.99,22.42 90 top
C15  57.73,21.8 180 top
C16  57.71,18.08 180 top
C17  38.73,12.82 270 top
C18  41.01,12.82 270 top
C19  43.56,22.42 90 top
C20  41.27,22.42 90 top
C21  51.52,16.2 90 top
C22  53.71,16.2 90 top
D1  65.56,5.11 180 top
D2  58.09,5.11 180 top
D3  50.42,5.11 180 top
D4  42.8,5.11 180 top
D5  35.18,5.11 180 top
D7  44.76,12.34 180 top
D8  6.63,23.65 180 top
FLEX1  3.56,1.63 0 top
FLEX2  9.65,1.58 0 top
FLEX3  15.62,1.58 0 top
FLEX4  21.97,1.58 0 top
FLEX5  28.32,1.58 0 top
JP1  3.81,14.24 180 top
L1  29.49,9.34 270 top
L2  26.52,9.45 180 top
LED1  52.75,24.06 180 top
LIPO1  62.26,16.45 270 top
MCU1  18.04,17.03 180 top
Q1  65.66,9.06 180 top
Q2  58.04,9.16 180 top
Q3  50.42,9.16 180 top
Q4  42.8,9.16 180 top
Q5  35.18,9.16 180 top
R1  6.48,5.22 180 top
R2  10.16,5.22 180 top
R3  17.78,5.22 180 top
R4  22.86,5.22 180 top
R5  26.71,5.22 180 top
R6  59.01,12.61 0 top
R7  59.04,14.92 0 top
R8  53.09,12.21 0 top
R9  49.28,12.21 0 top
R10  34.16,12.06 0 top
R11  61.72,9.03 270 top
R12  64.84,12.03 180 top
R13  53.85,9.03 270 top
R14  46.48,9.03 270 top
R15  38.86,9.03 270 top
R16  9.82,23 180 top
R17  48.54,24.02 0 top
SUPPLY38  59.99,11.67 90 bottom
SUPPLY39  62.03,12.3 270 bottom
SW1  64.84,23.42 270 top
U$1  [PIB_LOGO_10MM]  28,21 0 bottom
VIBE1  65.55,1.55 0 top
VIBE2  58.15,1.55 0 top
VIBE3  50.4,1.55 0 top
VIBE4  42.8,1.55 0 top
VIBE5  35.2,1.55 0 top
VREG-MCU  39.12,17.57 180 top
VREG-VIBE  46.74,18.3 90 top
Y1  12.83,8.53 0 top

### Tracks (layer width: path | path; a pad name or v marks a point on that pad's centre or on a via)
3.3V
  Top 0.152: VREG-VIBE.3 48.89,14.95 | 46.27,12.34 D7.A
  Top 0.254: 49,14.85 48.89,14.95
  Top 0.508: VREG-VIBE.3 49.05,13.83 48.69,13.48 47.39,13.48 46.69,12.77 46.69,12.75 46.27,12.34 | 49,14.85 49.42,15.27 C21.1 C22.1 54.24,15.27 55.63,13.88 55.63,13.1 55.25,12.72 55.25,9.31 55.25,3.56 52.33,0.64 | VIBE5.1 35.49,0.64 43.56,0.64 | 43.56,0.64 51.31,0.64 | 51.31,0.64 52.33,0.64 | 52.33,0.64 58.8,0.64 | VIBE4.1 43.09,0.64 43.56,0.64 | VIBE3.1 50.69,0.64 51.31,0.64 | VIBE2.1 58.44,0.64 58.8,0.64 | VIBE1.1 64.01,0.64 58.8,0.64
  Top 0.635: D1.K 64.07,2.4 VIBE1.1 | D2.K 56.6,2.47 VIBE2.1 | VIBE3.1 48.93,2.39 D3.K | VIBE4.1 41.31,2.41 D4.K | D5.K 33.69,2.43 VIBE5.1
AGND  (via drill 0.25)
  Top 0.152: R2.2 9.77,5.22 v10.15,5.6
  Top 0.254: C11.1 23.56,7.4 23.56,7.04 24.39,6.22 24.72,6.22 R5.2 25.99,5.5 26.4,5.5 v26.75,5.7 | R4.2 21.38,5.71 v21.38,6.5 C10.1 | C8.1 19.15,6.85 v19,6.7 | R3.2 16.28,5.22 16,5.5 v15.8,5.5 | R1.2 5.56,5.3 6.5,5.3 v6.5,5.33 | MCU1.58 18.79,11.21 v18.8,11.2 | MCU1.61 20.29,12.98 20.57,13.27 20.61,13.27 21.22,13.27 21.45,13.5 21.45,14.35 20.27,15.53 MCU1.P$1 20.29,16.28 MCU1.7 | L1.2 29.49,7.38 v29.34,7.23 | 26.25,15.58 26.29,15.61 | 26.18,17.5 26.24,17.44 | MCU1.10 20.29,17.78 MCU1.P$4
  Top 0.635: R4.2 19.74,3.1 19.74,1.44 20.48,0.7 24.46,0.7 25.71,1.95 R5.2
  other vias: 24.16,18.46 24.16,17.59 31.5,17.67 32.18,17.16 31.52,16.78 32.26,16.3 31.52,15.94 32.18,15.46 31.52,14.9 32.21,14.6 29.62,14.39 32.18,18.05 31.52,18.51
  pour Bottom: 6,6 3,6 2.9,4.3 30.5,4.5 31.21,4.55 31.15,12.65 31.1,14.15 34.98,14.22 34.98,18.81 14.15,18.83 14,13.5
  pour Top (rank 2): 19.89,18.81 19.89,15.92 23.39,15.92 23.39,13.78 35.13,13.78 35.13,18.81
AVCC  (via drill 0.25)
  Top 0.254: MCU1.59 19.29,13.34 19.85,13.9 v20.8,13.9
  Top 0.635: v23.65,1.49 23.65,3.7 v23.5,3.85
  Top 0.762: 25.5,9.47 25.39,9.58 C11.2 23.5,9.54 v23.5,10.5 | L2.2 25.5,9.47 | 25.5,9.47 v25.1,10.75 | C10.2 21.4,9.5 v21.4,10.5
  Bottom 0.254: v25.1,10.75 24.1,11.75 24.05,11.75 24.03,11.77 21.48,11.77 21.18,12.07 21.18,13.52 v20.8,13.9
  Bottom 0.635: v21.4,10.5 v23.5,10.5 v23.5,3.85 | FLEX1.1 3.87,0.7 9.91,0.7 | 23.01,0.7 v23.65,1.49 | 9.91,0.7 15.88,0.7 | 15.88,0.7 22.23,0.7 | 22.23,0.7 23.01,0.7 | FLEX5.1 26.81,0.7 23.01,0.7 | FLEX2.1 9.91,0.7 | FLEX3.1 15.88,0.7 | FLEX4.1 22.23,0.7
FLEX-INDEX
  Top 0.152: R2.1 11.22,5.28 | 11.22,5.28 12.07,6.14 15.8,6.14 15.8,6.57 15.81,6.57 15.81,7.98 15.8,7.98 15.8,8.11 16.19,8.49 20.04,8.49 20.42,8.87 20.42,10.39 21.79,11.76 MCU1.64 | FLEX2.2 11.22,2.52 11.22,5.28
FLEX-MIDDLE
  Top 0.152: FLEX3.2 18.78,4.12 R3.1 20.46,6.9 20.46,8.35 20.72,8.52 21.96,8.52 22.3,8.85 22.3,11.03 23.53,12.26 23.53,13.1 23.35,13.28 MCU1.1
FLEX-PINKY
  Top 0.152: MCU1.3 23.54,14.28 24.14,13.68 24.14,11.82 24.56,11.45 25.33,11.45 26.4,10.38 26.4,6.55 26.58,6.37 27.48,6.37 27.71,6.14 R5.1 27.71,2.82 FLEX5.2
FLEX-RING
  Top 0.152: MCU1.2 23.6,13.78 23.84,13.55 23.84,12.13 22.65,10.94 22.65,6.44 R4.1 22.6,3.96 FLEX4.2
FLEX-THUMB
  Top 0.152: MCU1.63 21.29,11.69 20.07,10.47 20.07,8.95 19.91,8.8 16.35,8.8 16.34,8.8 14.2,8.8 11.8,6.4 8,6.4 7.48,5.88 R1.1 7.48,4.08 5.04,1.63 FLEX1.2
GND  (via drill 0.25)
  Top 0.152: C2.2 8.6,9.56 v8.6,10.5
  Top 0.254: R14.1 46.5,10.01 v46.5,9 | v66.8,12.05 65.86,12.05 R12.1 | R13.1 53.25,9.43 v53.25,9 | C6.1 25.53,7.2 24.91,7.2 v24.61,6.75 | v14.7,3.7 14.8,3.8 17.15,3.8 17.8,4.45 17.8,5.7 v17,6.5 17,7.38 17.02,7.4 C1.2 | R11.1 61.72,9.22 61.7,9.2 v61.7,9.1 | MCU1.33 12.32,20.78 v12.2,20.9 | MCU1.35 12.23,19.78 v12.2,19.75 | C9.1 v7.96,20.81 v7.95,20.8 | MCU1.45 11.97,14.78 v11.95,14.8 | MCU1.55 17.29,11.65 v16.77,11.13 | VREG-MCU.2 40.23,16.78 v39.95,16.5 39.15,17.3 39.15,19.7 38.5,20.35 35.91,20.35 35.31,20.95 35.31,22.8 35.85,23.35 C12.2 C13.2 40.09,24.45 46.1,24.45 46.53,24.02 R17.1 | VREG-MCU.1 v40.01,15.51 v40,15.5 | C16.2 56.26,18.1 v57.7,18.1 | C15.2 v57.75,21.8 | MCU1.24 18.29,20.84 v18,20.55 | MCU1.20 20.29,20.66 v20.55,20.4 | MCU1.11 21.84,18.28 v21.53,19.5 | C17.2 38.73,11.39 39.24,10.88 39.71,10.88 | C18.2 40.07,10.95 v39.92,10.95 39.78,10.95 39.71,10.88 | R15.1 39.71,10.88 | C7.1 31.24,3.97 31.28,3.92 31,3.64 v31,3.6
  Bottom 0.254: v24.61,6.75 24.61,3.4 23.76,2.56 23.62,2.56 15.84,2.56 v14.7,3.7 | v16.77,11.13 17,10.9 v17,6.5
  pour Bottom (rank 2): 23.5,17.5 23.5,23.8 0.3,23.8 0.2,23.7 0.2,0.3 70.9,0.2 70.9,4 71,10 71,26.6 49.45,26.45 49.5,21.1 55.4,21.1 55.5,11.65 67.55,11.65 67.55,10.45 67.6,10.4 61.4,10.4 42,10.4 42,16.8 37.5,16.8 37.5,10 31.5,10 31.5,4 2.3,3.9 2.3,6.3 2.6,6.6 5.7,6.6 13.5,14.6 13.5,17.6 15,18.9 21.4,18.9 21.4,17.6 23.4,17.6
INDEX-VIBE  (via drill 0.25)
  Top 0.152: R7.1 57.45,15.52 v57.45,16.05 | v15.2,13.69 14.79,13.28 MCU1.50
  Bottom 0.152: v57.45,16.05 57.59,16.3 60.23,16.3 60.41,16.47 60.41,23.53 59.43,24.5 36.77,24.5 35.59,23.33 35.59,13.6 35.45,13.46 30.59,13.46 29.97,12.84 22.7,12.84 22.25,13.29 22.25,14.14 21.29,15.09 20.26,15.09 19.62,14.45 16.02,14.45 15.26,13.69 v15.2,13.69
MIDDLE-VIBE  (via drill 0.25)
  Top 0.152: MCU1.51 15.29,13.04 v15.9,13.65 | R8.1 52.09,12.41 52.09,12.46 52.09,13.13 52.05,13.17 52.5,13.63 v54.94,13.63 | v54.97,15.52 56.17,15.52 v56.78,16.12
  Bottom 0.152: v15.9,13.65 16.39,14.14 19.74,14.14 20.39,14.79 21.17,14.79 21.94,14.01 21.94,12.96 22.37,12.53 30.09,12.53 30.71,13.15 35.7,13.15 35.9,13.35 35.9,23.2 36.9,24.2 59.3,24.2 60.1,23.4 60.1,16.6 57.2,16.6 56.75,16.15 v56.78,16.12 | v54.97,15.52 54.94,15.48 v54.94,13.63
MISO
  Top 0.152: AVR_ISP1.MISO 10.5,13.56 10.5,13.57 11,14.07 11,15.31 11,15.5 11,16.63 11.3,16.93 11.3,17.5 11.59,17.78 MCU1.39
MOSI
  Top 0.152: MCU1.38 11.38,18.28 11,17.9 11,17.06 10.69,16.75 10.69,14.64 10.01,13.96 8.14,13.96 6.99,15.12 AVR_ISP1.MOSI
N$1
  Top 0.508: VIBE1.2 67.05,2.42 D1.A 67.05,6.25 66.8,6.5 65,6.5 64.51,6.99 Q1.3
N$2
  Top 0.508: VIBE2.2 59.58,2.35 D2.A 59.58,6.42 59.5,6.5 57.5,6.5 56.89,7.11 Q2.3
N$3
  Top 0.508: VIBE3.2 51.91,2.43 D3.A 51.91,6.29 51.7,6.5 50,6.5 49.27,7.23 Q3.3
N$4
  Top 0.508: VIBE4.2 44.29,2.41 D4.A 44.29,6.21 44,6.5 42.5,6.5 41.65,7.35 Q4.3
N$5
  Top 0.152: 34.03,9 Q5.3
  Top 0.508: VIBE5.2 36.67,2.39 D5.A 36.67,6.33 36.5,6.5 34.5,6.5 34.03,6.97 34.03,9
N$6
  Top 0.152: C2.1 10.58,7.53 Y1.1 12.02,7.28 12.84,8.09 12.84,9.54 13.95,10.65 16.97,10.65 17.79,11.47 MCU1.56
N$7
  Top 0.152: Y1.3 14.94,9.66 C1.1 17.02,10.27 18.29,11.54 MCU1.57
N$8
  Top 0.254: C3.2 27.59,15.89 BALUN1.2
N$9
  Top 0.254: C4.1 27.94,17.5 BALUN1.1
  pour Top (no thermals): 29.34,18.35 29.34,17.9 28.42,16.98 28.42,16.83 28.42,16.37 29.34,16.37 29.34,16.98 29.8,17.44 29.8,18.35
N$10
  Top 0.254: MCU1.9 23.46,17.28 23.98,16.77 23.98,14.93 24.3,14.6 24.36,14.54 25.32,13.58 25.33,13.58 arc90 25.68,13.94 arc-90 25.96,14.42 26.27,14.42 arc-90 26.59,13.94 arc90 26.9,13.61 27.2,13.61 arc90 27.51,13.94 arc-90 27.81,14.42 27.97,14.42 arc-90 28.27,13.94 28.58,13.94 arc90 28.89,14.25 BALUN1.3
N$11
  Top 0.254: MCU1.8 23.39,16.78 23.57,16.6 23.57,14.76 23.9,14.43 24.07,14.26 25.15,13.17 29.64,13.17 30.35,13.88 BALUN1.4
N$12
  Top 0.152: C5.1 6.61,22 4,22 3.81,21.81 JP1.DTR
N$14
  Top 0.152: Q2.1 59.24,8.04 R11.2 62.47,8.04 63.19,8.76 63.19,11.32 61.9,12.61 R6.2
N$15  (via drill 0.25)
  Top 0.508: SW1.2 v64.09,20.47 v64.08,20.46
  Bottom 0.508: v64.08,20.46 64.08,19.27 LIPO1.+
N$16
  Top 0.152: R7.2 62.92,12.03 R12.2 63.85,12.95 64.15,13.25 67.35,13.25 67.81,12.79 67.81,8.21 67.71,8.11 Q1.1
N$18
  Top 0.152: Q3.1 51.62,8.04 R13.2 53.85,8.6 54.63,9.38 54.77,9.52 54.77,11.52 R8.2
N$19  (via drill 0.25)
  Top 0.254: v29.82,12 29.82,11.83 29.43,11.44 29.43,10.39 L1.1
  Bottom 0.254: SUPPLY39.P$2 62.03,11.18 61.15,10.3 48,10.3 47.93,10.37 47.93,12.74 47.59,13.08 47.11,13.08 46.77,12.74 46.77,12.26 46.99,12.03 46.99,10.76 42.8,10.76 42.76,10.8 42.76,16.49 41.89,17.36 37.85,17.36 36.94,16.45 36.94,10.66 33.85,10.66 33.09,11.42 33.09,11.97 32.57,12.49 31.83,12.49 31.61,12.26 30.33,12.26 30.24,12.18 29.99,12.18 v29.82,12
N$20
  Top 0.152: Q4.1 44,8.04 R14.2 48.02,9.57 48.02,10.71 48.15,10.84 49.28,10.84 50.27,11.83 R9.2
N$21
  Top 0.152: MCU1.60 19.79,10.98 19.15,10.35 C8.2
N$22
  Top 0.152: R15.2 38,8.04 | 38,8.04 36.38,8.04 Q5.1 | 38,8.04 37.65,8.39 37.65,11.55 37.14,12.06 R10.2
N$23
  Top 0.152: C9.2 11.26,20.81 13.05,22.6 19,22.6 | MCU1.22 19.29,22.32 19.05,22.55 19,22.6 | 19,22.6 19.65,22.6 19.79,22.46 MCU1.21
N$25
  Top 0.152: R17.2 51.51,24.02 LED1.K
NGND  (via drill 0.25)
  Top 0.152: Q3.2 51.45,11.04 v51.4,11.1
  Top 0.254: C20.2 C19.2 v44.85,23.35 | Q4.2 44.5,10.79 v44.5,11.5 | VREG-VIBE.2 45.8,15.11 45.8,15.1 v45.7,15.1 | Q5.2 36.2,11.1 v36.2,11.29 | Q1.2 66.69,10.88 v66.7,11.05 | v62.65,10.9 61.15,10.9 v61.05,11 | C21.2 51.52,18.09 v51.55,18.12 | C22.2 53.71,18.16 v53.7,18.17 | v46.75,19.5 v46.74,19.5 VREG-VIBE.4 46.74,23.09 v46.6,23.1 | Q2.2 58.95,10.22 58.95,11 v58.85,11.1
  pour Bottom (rank 6): 31.55,13.73 31.65,10.5 37.1,10.5 37.2,10.6 37.2,17.2 42.5,17.2 42.5,8.65 61,8.65 61.05,8.7 61.05,10.1 67.95,10.1 67.9,10.15 67.9,12.5 54.94,12.5 54.94,20.93 49.5,20.95 49.5,25.5 35.6,25.5 35.6,25.1 35.5,13.73
PINKY-VIBE  (via drill 0.25)
  Top 0.152: R10.1 32.71,11.6 v32.2,11.6 | MCU1.41 12.61,16.78 v12.32,16.5
  Bottom 0.152: v32.2,11.6 30.6,11.6 30.5,11.5 30.5,4.5 25.5,4.5 25.06,4.94 25.16,6.71 25.16,7.49 24.93,7.73 24.77,7.73 24.11,8.39 24.11,10.75 23.75,11.11 21.15,11.11 20.79,10.75 20.79,10.25 21.15,9.89 22.89,9.89 22.89,4.5 3,4.5 3,6.6 3.1,6.7 5.5,6.7 12.82,14.03 12.82,16 v12.32,16.5
RESET
  Top 0.152: R16.2 8.8,23 8,23 | D8.A 7.35,23.65 8,23 | 8,23 7.75,22.74 7.75,22.4 | 7.75,22.4 7.75,21.5 7.25,21 6.85,21 6.63,20.78 C5.2 6.73,20.27 6.73,19.06 5.82,18.15 5.82,17.18 6.5,16.5 8.37,16.5 9.53,17.66 AVR_ISP1.RESET | MCU1.12 23.35,18.78 23.55,18.98 23.55,21 23.55,21.45 20.16,24.84 14.86,24.84 11.92,21.9 8.25,21.9 7.75,22.4
RING-VIBE  (via drill 0.25)
  Top 0.152: R9.1 47.99,12.5 v47.35,12.5 | MCU1.40 12.24,17.28 v12.15,17.19
  Bottom 0.152: v47.35,12.5 47.35,10.4 42.5,10.4 42.4,10.5 42.4,12.5 42.4,16.3 41.7,17 38.05,17 37.3,16.25 37.3,10.5 37.1,10.3 33.7,10.3 32.73,11.27 32.73,11.82 32.42,12.13 31.98,12.13 31.75,11.9 30.47,11.9 30.2,11.63 30.2,5 30,4.8 25.63,4.8 25.47,5.06 25.47,6.7 25.48,6.81 25.47,6.82 25.47,7.62 25.05,8.04 24.97,8.04 24.41,8.59 24.41,10.88 23.88,11.41 21.02,11.41 20.49,10.88 20.49,10.12 21.02,9.59 22.41,9.59 22.5,9.5 22.5,4.8 3.3,4.8 3.3,6.39 5.63,6.39 13.13,13.9 13.13,16.82 12.76,17.19 v12.15,17.19
RXO
  Top 0.152: JP1.TXO 5.61,13.76 7.47,13.76 8.15,13.07 8.15,12.31 9.04,11.42 10.01,11.42 10.69,12.11 10.69,13.1 10.69,13.19 11.78,14.28 MCU1.46
SCK
  Top 0.152: AVR_ISP1.SCK 9.53,16.02 10.69,17.18 10.69,18.39 11.08,18.78 MCU1.37
THUMB-VIBE  (via drill 0.25)
  Top 0.152: R6.1 58.8,13.4 v58.8,13.8 | v14.54,13.75 14.29,13.5 MCU1.49
  Bottom 0.152: v58.8,13.8 58.8,14.2 58.6,14.4 58.6,15.99 60.35,15.99 60.71,16.35 60.71,23.65 59.55,24.81 36.65,24.81 35.29,23.45 35.29,18.5 35.29,18.31 35.29,13.85 35.2,13.76 30.46,13.76 29.84,13.14 22.95,13.14 22.55,13.54 22.55,14.27 21.42,15.4 20.14,15.4 19.49,14.75 15.58,14.75 14.57,13.75 v14.54,13.75
TXO
  Top 0.152: JP1.RXI 2.5,16.79 2.5,15.19 3.5,14.19 4.75,14.19 5.82,13.12 5.82,12.11 6.81,11.12 10.14,11.12 11,11.98 11,13.07 11.71,13.78 MCU1.47
VBAT
  Top 0.152: VREG-VIBE.1 44.54,15.49 | 59.16,21.85 C15.1
  Top 0.508: C12.1 C13.1 C20.1 | C20.1 C19.1 | 44.54,15.49 44.55,17.68 43.94,18.2 | 43.94,18.2 VREG-MCU.3 VREG-MCU.4 41.27,19.86 C20.1 | VREG-VIBE.1 44.45,13.82 D7.K | 43.94,18.2 49.15,18.2 53.95,22.85 LED1.A 58.83,24.06 59.21,23.69 59.21,22.16 | 59.21,22.16 59.21,21.9 59.16,21.85 | 59.21,22.16 59.19,22.14 C16.1 59.21,18.05 60.73,18.05 61.95,19.27 64.68,19.27 SW1.1
VCC  (via drill 0.25)
  Top 0.152: D8.K 5.8,23.65 5.5,23.95 5.5,24.35 5.99,24.84 10.56,24.84 10.81,24.59 R16.1
  Top 0.254: 14.48,19.98 14.17,20.28 MCU1.34 11.88,20.28 v11.84,20.32 | 14.48,19.98 14.55,19.91 18.41,19.91 18.79,20.29 MCU1.23 | MCU1.54 16.79,13.19 | 16.79,13.19 17.01,13.41 17.79,13.41 v18.04,13.66 | MCU1.44 14.22,15.28 | 14.22,15.28 15.25,14.25 16.3,14.25 16.79,13.77 16.79,13.19 | 14.22,15.28 14.48,15.55 14.48,19.98 | v11.99,22.66 11.66,23 R16.1 | L2.1 27.2,9.77 27.2,10.28 v26.54,10.94
  Top 0.508: VREG-MCU.5 VREG-MCU.6 37.87,18.2 38.48,17.59 38.48,13.99 C17.1 | C18.1 C17.1 | C17.1 36.31,13.74 35.89,13.33 32.08,13.33 31.32,12.56 31.32,7.89 29.39,5.96 C7.2
  Top 0.635: C7.2 29.04,6.16 28.88,6.16 27.7,7.35 27.52,7.35
  Top 0.762: C6.2 27.52,7.35 L2.1
  Bottom 0.254: v11.84,20.32 11.5,20.67 11.5,21.05 11.99,21.54 v11.99,22.66 | v18.04,13.66 18.09,13.71 19.86,13.71 20.58,14.43 21.02,14.43 21.59,13.87 21.59,12.29 21.7,12.18 24.43,12.18 25.63,10.97 26.51,10.97 v26.54,10.94

### Text on the board
tPlace: Rev 1 | Transmission of Touch
bPlace: Transmission of Touch | Rev 1 | CADed by: Odeh Saba